# Altium schematic sheet encoder-filter.SchDoc
size A4; SheetNumber: 2; SheetTotal: 9
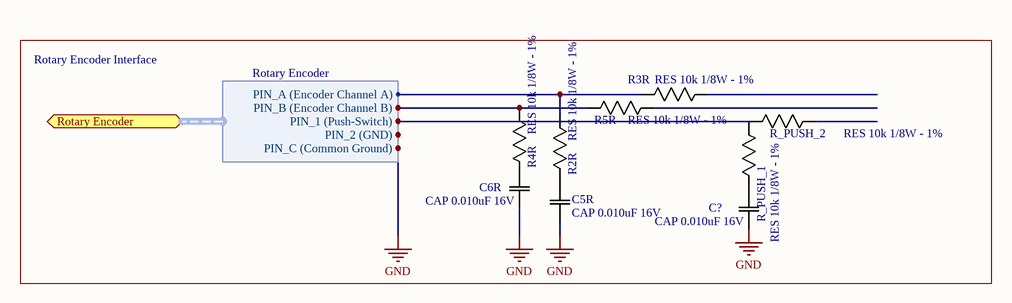
[diagram p0: encoder-filter.SchDoc]

## Parts
C5R  CAP 0.010uF 16V  [0603]
C6R  CAP 0.010uF 16V  [0603]
C?  CAP 0.010uF 16V  [0603]
R2R  RES 10k 1/8W - 1%  [0603]
R3R  RES 10k 1/8W - 1%  [0603]
R4R  RES 10k 1/8W - 1%  [0603]
R5R  RES 10k 1/8W - 1%  [0603]
R_PUSH_1  RES 10k 1/8W - 1%  [0603]
R_PUSH_2  RES 10k 1/8W - 1%  [0603]

## Blocks framed on the sheet
Rotary Encoder Interface: C5R C6R C? R2R R3R R4R R5R R_PUSH_1 R_PUSH_2

## Ports
Rotary Encoder (bidir, harness Rotary Encoder)

## Harnesses
Rotary Encoder: PIN_A (Encoder Channel A), PIN_B (Encoder Channel B), PIN_1 (Push-Switch), PIN_2 (GND), PIN_C (Common Ground)

## Nets
GND: C5R.1(C1) C6R.1(C1) C?.1(C1) R4R.1(R1) R5R.2(R2) R_PUSH_1.1(R1) R_PUSH_2.2(R2) ; port Rotary Encoder.PIN_B (Encoder Channel B), port Rotary Encoder.PIN_1 (Push-Switch), port Rotary Encoder.PIN_2 (GND), port Rotary Encoder.PIN_C (Common Ground)
NetC5R_2: C5R.2(C2) R2R.2(R2)
NetC?_2: C?.2(C2) R_PUSH_1.2(R2)
NetR2R_1: R2R.1(R1) R3R.2(R2) ; port Rotary Encoder.PIN_A (Encoder Channel A)

Not connected (* = marked no-connect by the designer): C6R 2(C2); R3R 1(R1); R4R 2(R2); R5R 1(R1); R_PUSH_2 1(R1)

## Library data of the parts
C5R C6R C? = CAP 0.010uF 16V: Default Symbol for Capacitors; Temperature Coefficient: X5R; Tolerance: 10%; Value: 0.010uF; Rating: 16V; Operating Temperature: -55°C ~ 125°C; Part Number: CAP 0.010uF 16V
R2R R3R R4R R5R R_PUSH_1 R_PUSH_2 = RES 10k 1/8W - 1%: Default Resistor Symbol; Value: 1; Power (Watts): 0.125W; Tolerance: 5%; Package: 0805; Part Number: RES 10k 1/8W - 1%